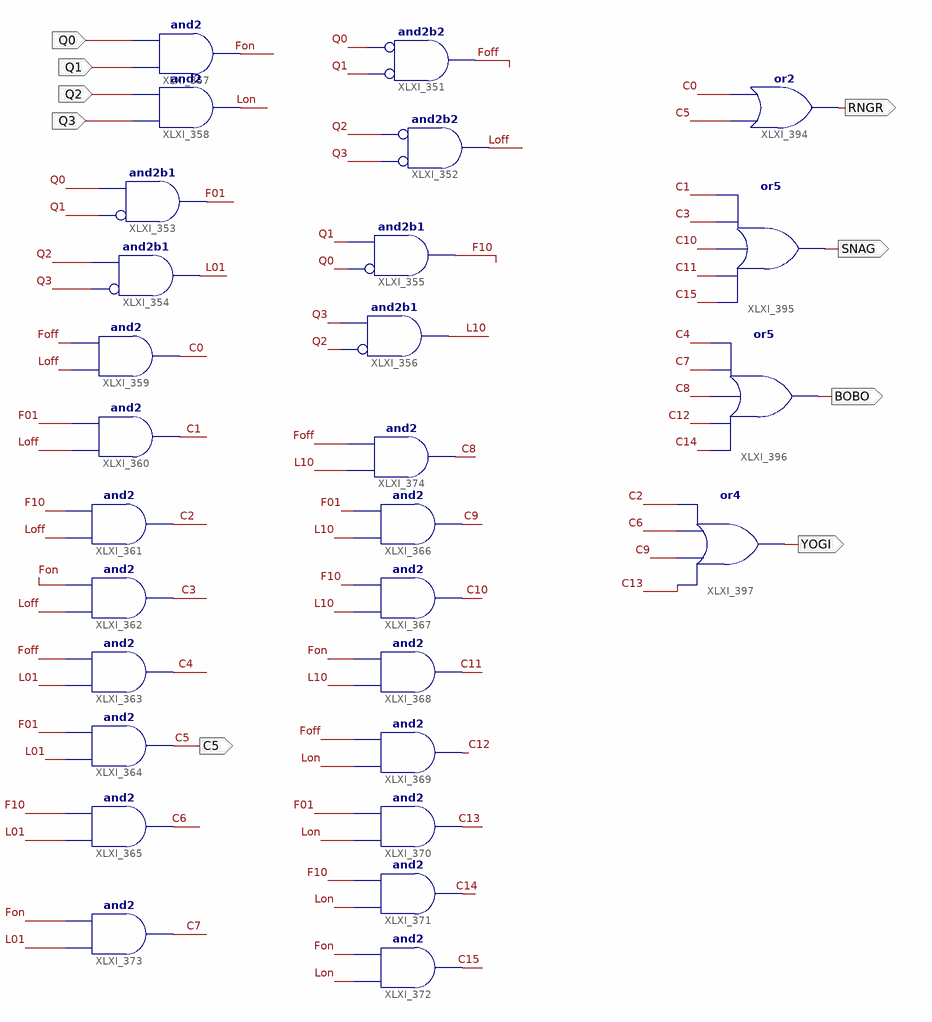
[diagram p0: schematic sheet 1]
// Xilinx ISE schematic stateCount.sch (spartan3e) as structural Verilog: 28 symbols, 9 ports
module stateCount (
  input  Q0,
  input  Q3,
  input  Q2,
  input  Q1,
  output C5,
  output RNGR,
  output SNAG,
  output BOBO,
  output YOGI
);

  wire C0, C1, C2, C3, C4, C6, C7, C8, C9, C10, C11, C12, C13, C14, C15, F01, F10, Foff, Fon, L01, L10, Loff,
       Lon;

  and XLXI_351 (Foff, ~Q1, ~Q0);  // and2b2
  and XLXI_352 (Loff, ~Q3, ~Q2);  // and2b2
  and XLXI_357 (Fon, Q1, Q0);
  and XLXI_358 (Lon, Q3, Q2);
  and XLXI_373 (C7, L01, Fon);
  and XLXI_353 (F01, ~Q1, Q0);  // and2b1
  and XLXI_354 (L01, ~Q3, Q2);  // and2b1
  and XLXI_355 (F10, ~Q0, Q1);  // and2b1
  and XLXI_356 (L10, ~Q2, Q3);  // and2b1
  and XLXI_359 (C0, Loff, Foff);
  and XLXI_360 (C1, Loff, F01);
  and XLXI_361 (C2, Loff, F10);
  and XLXI_362 (C3, Loff, Fon);
  and XLXI_363 (C4, L01, Foff);
  and XLXI_364 (C5, L01, F01);
  and XLXI_365 (C6, L01, F10);
  and XLXI_366 (C9, L10, F01);
  and XLXI_367 (C10, L10, F10);
  and XLXI_368 (C11, L10, Fon);
  and XLXI_369 (C12, Lon, Foff);
  and XLXI_370 (C13, Lon, F01);
  and XLXI_371 (C14, Lon, F10);
  and XLXI_372 (C15, Lon, Fon);
  and XLXI_374 (C8, L10, Foff);
  or XLXI_394 (RNGR, C5, C0);
  or XLXI_395 (SNAG, C15, C11, C10, C3, C1);
  or XLXI_396 (BOBO, C14, C12, C8, C7, C4);
  or XLXI_397 (YOGI, C13, C9, C6, C2);
endmodule
